# Altium schematic sheet ESP-Interface.SchDoc
size A4; SheetNumber: 3; SheetTotal: 9
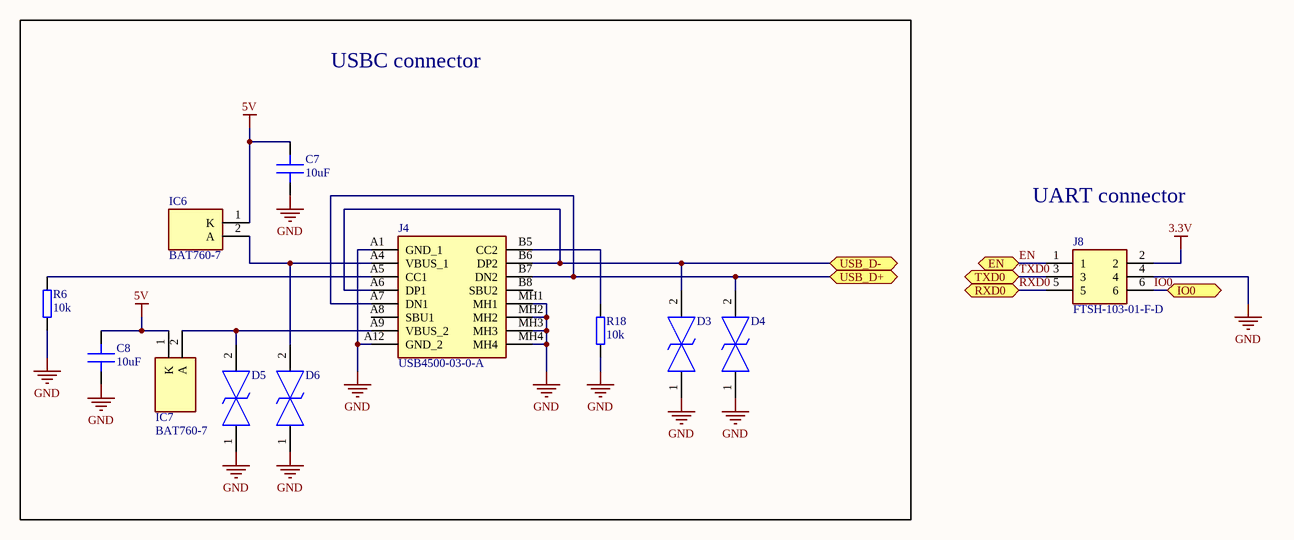
[diagram p0: ESP-Interface.SchDoc]

## Parts
C7  10uF  [C 0402]
C8  10uF  [C 0402]
D3  LESD5D5.0CT1G  [LESD5D50CT1G]  (value not drawn)
D4  LESD5D5.0CT1G  [LESD5D50CT1G]  (value not drawn)
D5  LESD5D5.0CT1G  [LESD5D50CT1G]  (value not drawn)
D6  LESD5D5.0CT1G  [LESD5D50CT1G]  (value not drawn)
IC6  BAT760-7  [SOD2513X120N]
IC7  BAT760-7  [SOD2513X120N]
J4  USB4500-03-0-A  [USB4500030A]
J8  FTSH-103-01-F-D  [FTSH-103-XX-YYY-D]
R6  10k  [R 0402]
R18  10k  [R 0402]

## Blocks framed on the sheet
USBC connector: C7 C8 D3-D6 IC6 IC7 J4 R6 R18

## Ports
EN (bidir), IO0 (bidir), RXD0 (bidir), TXD0 (bidir), USB_D+ (bidir), USB_D- (bidir)

## Nets
3.3V: J8.2
5V: C7.1 C8.1 IC6.1(K) IC7.1(K)
GND: C7.2 C8.2 D3.1 D4.1 D5.1 D6.1 J4.A1(GND_1) J4.A12(GND_2) J4.MH1 J4.MH2 J4.MH3 J4.MH4 J8.4 R6.1 R18.1
EN: J8.1 ; port EN
IO0: J8.6 ; port IO0
RXD0: J8.5 ; port RXD0
TXD0: J8.3 ; port TXD0
USB_D+: D4.2 J4.A7(DN1) J4.B7(DN2) ; port USB_D+
USB_D-: D3.2 J4.A6(DP1) J4.B6(DP2) ; port USB_D-
NetD5_2: D5.2 IC7.2(A) J4.A9(VBUS_2)
NetD6_2: D6.2 IC6.2(A) J4.A4(VBUS_1)
NetJ4_A5: J4.A5(CC1) R6.2
NetJ4_B5: J4.B5(CC2) R18.2

Not connected (* = marked no-connect by the designer): J4 A8(SBU1) B8(SBU2)

## Notes on the sheet
- UART connector

## Library data of the parts
C7 C8 = Capacitor: MLCC Capacitor
D3-D6 = LESD5D5.0CT1G: TVS Diode (Bi-directional); Manufacturer_Name: LRC; Height: 0.7mm; Manufacturer_Part_Number: LESD5D5.0CT1G
IC6 IC7 = BAT760-7: Integrated Circuit; Manufacturer_Name: Lattice Semiconductor; Datasheet Link: https://www.diodes.com/assets/Datasheets/ds30498.pdf; Height: 1.2mm; Manufacturer_Part_Number: BAT760-7; Mouser Part Number: N/A; Mouser Price/Stock: https://www.mouser.com/Search/Refine.aspx?Keyword=N%2FA
J4 = USB4500-03-0-A: Connector; Manufacturer_Name: GCT (GLOBAL CONNECTOR TECHNOLOGY); Datasheet Link: https://componentsearchengine.com/Datasheets/2/USB4500-03-0-A.pdf; Manufacturer_Part_Number: USB4500-03-0-A; Mouser Part Number: 640-USB4500030A; Mouser Price/Stock: https://www.mouser.co.uk/ProductDetail/GCT/USB4500-03-0-A?qs=7D1LtPJG0i2mVyw7UtV%2FkQ%3D%3D
J8 = FTSH-103-01-F-D: Connector; Manufacturer_Name: SAMTEC; Datasheet Link: http://suddendocs.samtec.com/prints/ftsh-1xx-xx-xxx-d-xxx-xx-mkt.pdf; Manufacturer_Part_Number: FTSH-103-01-F-D; Mouser Part Number: 200-FTSH10301FD; Mouser Price/Stock: https://www.mouser.co.uk/ProductDetail/Samtec/FTSH-103-01-F-D?qs=0lQeLiL1qyb7OHmlWV4egA%3D%3D; Arrow Part Number: FTSH-103-01-F-D; Arrow Price/Stock: https://www.arrow.com/en/products/ftsh-103-01-f-d/samtec
R6 R18 = Resistor: General pourpouse resistor